# Altium schematic sheet board_pa94 (2).SchDoc
size 840 x 594 mm; SheetNumber: 1; SheetTotal: 1; Scale: 1:1
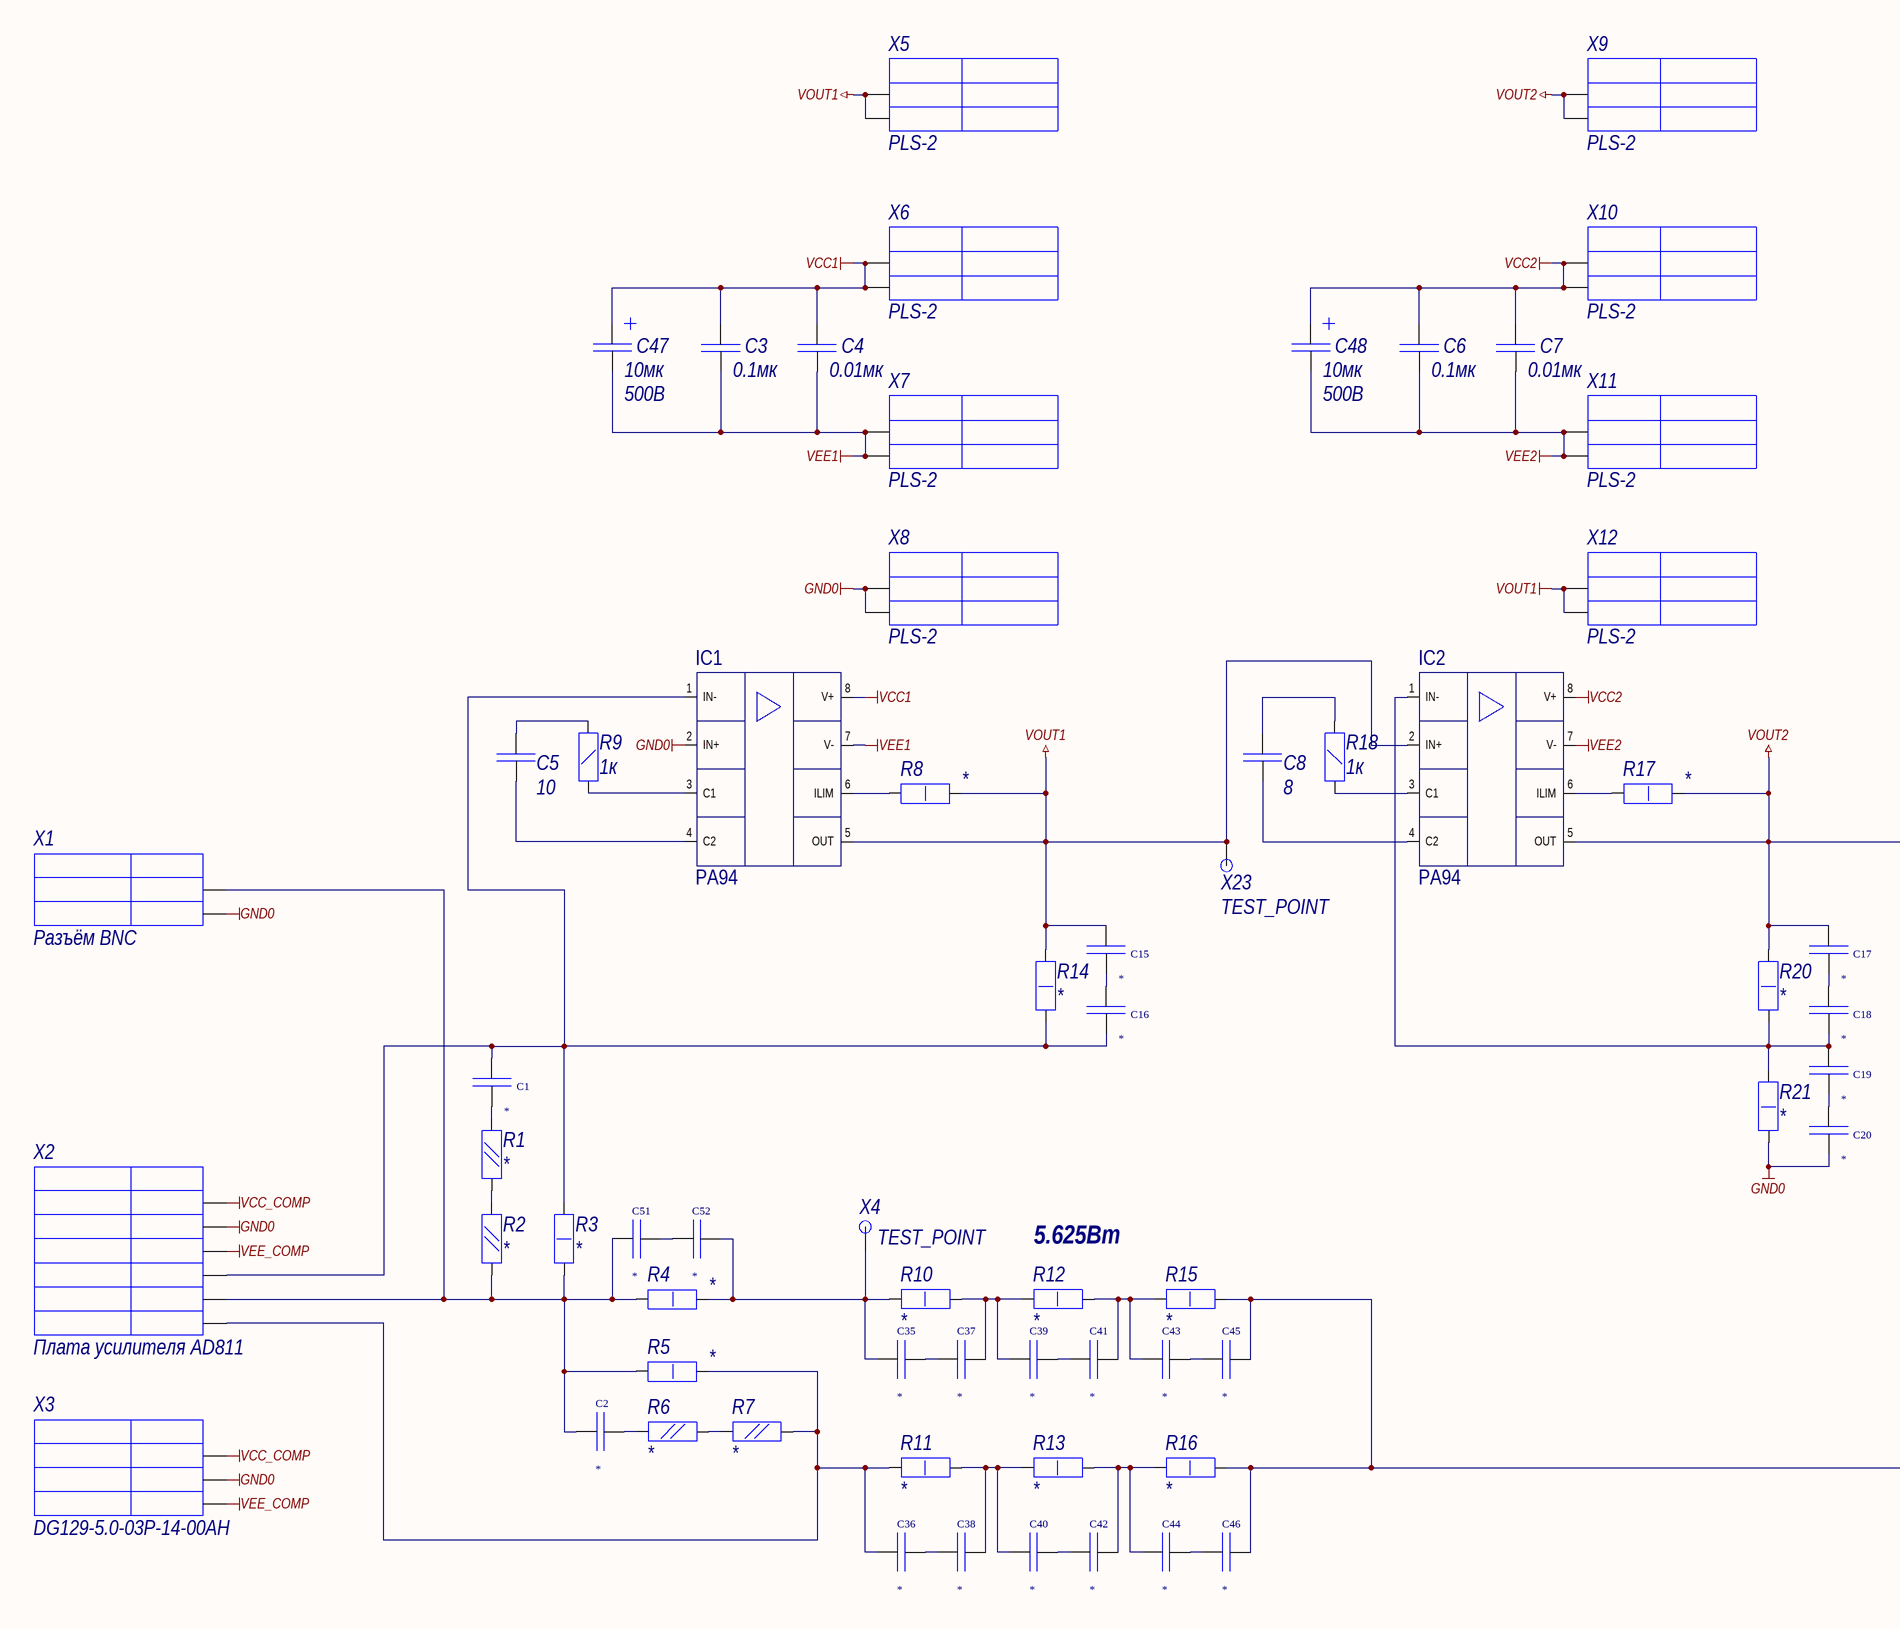
[diagram p0: board_pa94 (2).SchDoc, left]
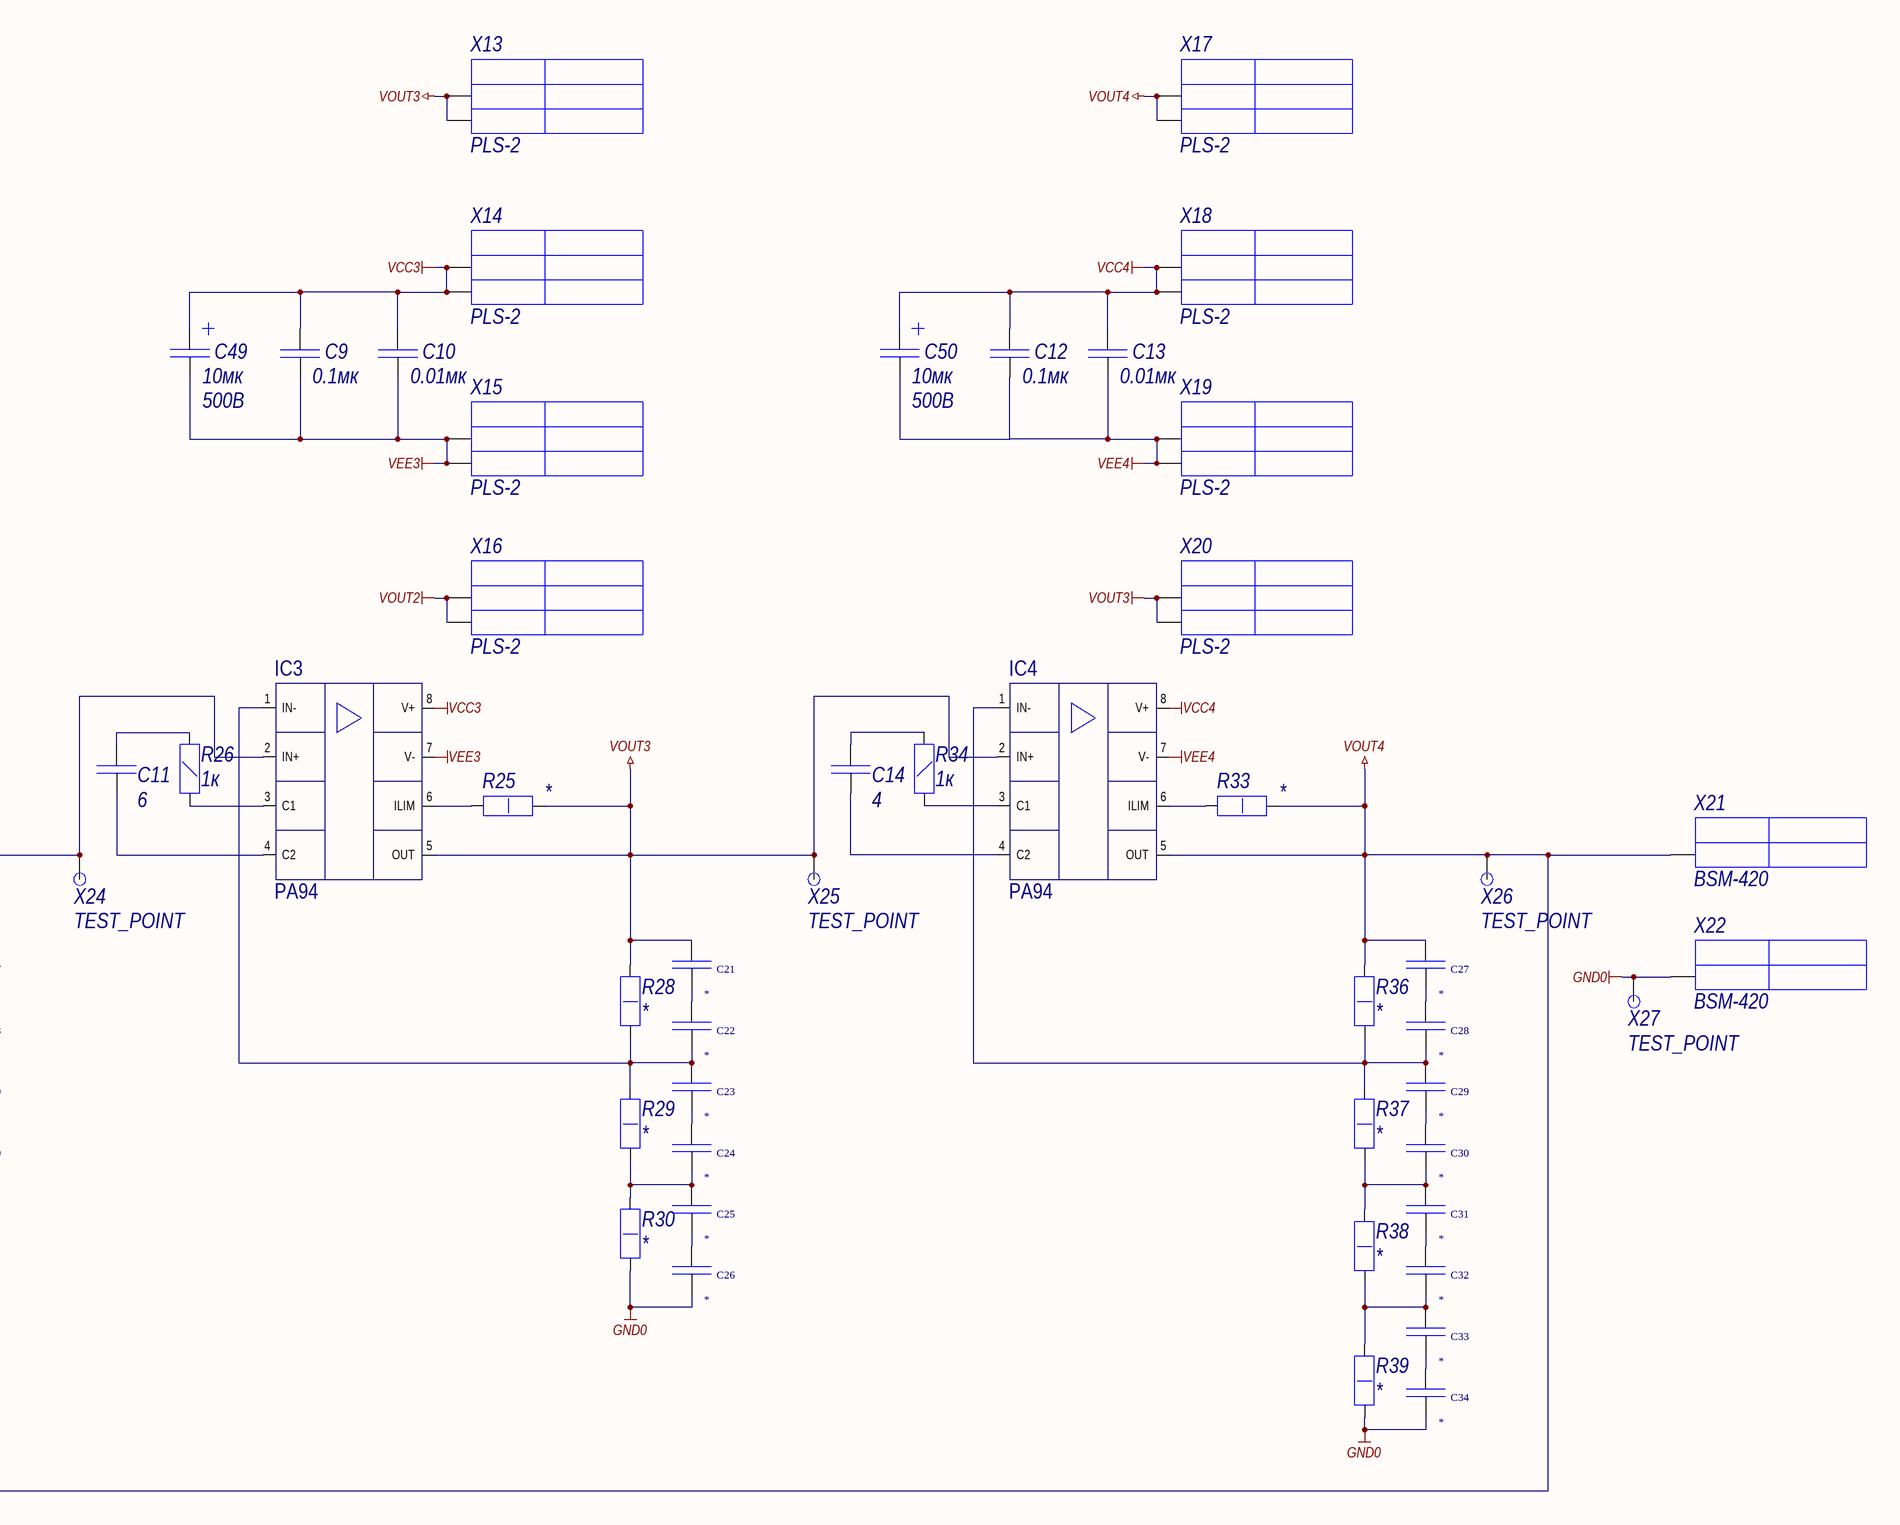
[diagram p1: board_pa94 (2).SchDoc, right]

## Parts
C1  *  [C-0805]
C2  *  [C-0805]
C3  0.1мк  [C-1812]
C4  0.01мк  [C-1206]
C5  10  [C-1206]
C6  0.1мк  [C-1812]
C7  0.01мк  [C-1206]
C8  8  [C-1206]
C9  0.1мк  [C-1812]
C10  0.01мк  [C-1206]
C11  6  [C-1206]
C12  0.1мк  [C-1812]
C13  0.01мк  [C-1206]
C14  4  [C-1206]
C15  *  [C-0805]
C16  *  [C-0805]
C17  *  [C-0805]
C18  *  [C-0805]
C19  *  [C-0805]
C20  *  [C-0805]
C21  *  [C-0805]
C22  *  [C-0805]
C23  *  [C-0805]
C24  *  [C-0805]
C25  *  [C-0805]
C26  *  [C-0805]
C27  *  [C-0805]
C28  *  [C-0805]
C29  *  [C-0805]
C30  *  [C-0805]
C31  *  [C-0805]
C32  *  [C-0805]
C33  *  [C-0805]
C34  *  [C-0805]
C35  *  [C-0805]
C36  *  [C-0805]
C37  *  [C-0805]
C38  *  [C-0805]
C39  *  [C-0805]
C40  *  [C-0805]
C41  *  [C-0805]
C42  *  [C-0805]
C43  *  [C-0805]
C44  *  [C-0805]
C45  *  [C-0805]
C46  *  [C-0805]
C47  10мк  Voltage: 500В  [CAP: D10C5H12.5]
C48  10мк  Voltage: 500В  [CAP: D10C5H12.5]
C49  10мк  Voltage: 500В  [CAP: D10C5H12.5]
C50  10мк  Voltage: 500В  [CAP: D10C5H12.5]
C51  *  [C-0805]
C52  *  [C-0805]
IC1  PA94  [PCBComponent_1]
IC2  PA94  [PCBComponent_1]
IC3  PA94  [PCBComponent_1]
IC4  PA94  [PCBComponent_1]
R1  *  [R-0805]
R2  *  [R-0805]
R3  *  [R-2512]
R4  *  [R-2512]
R5  *  [R-2512]
R6  *  [R-0805]
R7  *  [R-0805]
R8  *  [R-2512]
R9  1к  [R-1206]
R10  *  [R-2512]
R11  *  [R-2512]
R12  *  [R-2512]
R13  *  [R-2512]
R14  *  [R-2512]
R15  *  [R-2512]
R16  *  [R-2512]
R17  *  [R-2512]
R18  1к  [R-1206]
R20  *  [R-2512]
R21  *  [R-2512]
R25  *  [R-2512]
R26  1к  [R-1206]
R28  *  [R-2512]
R29  *  [R-2512]
R30  *  [R-2512]
R33  *  [R-2512]
R34  1к  [R-1206]
R36  *  [R-2512]
R37  *  [R-2512]
R38  *  [R-2512]
R39  *  [R-2512]
X1  Разъём BNC  [BNC]
X2  Плата усилителя AD811  [BOARD_AD811]
X3  DG129-5.0-03P-14-00AH  [DG129-5.0-03P-14-00AH]
X4  TEST_POINT  [TEST_POINT]  (net tie, no BOM)
X5  PLS-2  [PLS-2]
X6  PLS-2  [PLS-2]
X7  PLS-2  [PLS-2]
X8  PLS-2  [PLS-2]
X9  PLS-2  [PLS-2]
X10  PLS-2  [PLS-2]
X11  PLS-2  [PLS-2]
X12  PLS-2  [PLS-2]
X13  PLS-2  [PLS-2]
X14  PLS-2  [PLS-2]
X15  PLS-2  [PLS-2]
X16  PLS-2  [PLS-2]
X17  PLS-2  [PLS-2]
X18  PLS-2  [PLS-2]
X19  PLS-2  [PLS-2]
X20  PLS-2  [PLS-2]
X21  BSM-420  [BSM-420-R]
X22  BSM-420  [BSM-420-B]
X23  TEST_POINT  [TEST_POINT]  (net tie, no BOM)
X24  TEST_POINT  [TEST_POINT]  (net tie, no BOM)
X25  TEST_POINT  [TEST_POINT]  (net tie, no BOM)
X26  TEST_POINT  [TEST_POINT]  (net tie, no BOM)
X27  TEST_POINT  [TEST_POINT]  (net tie, no BOM)

## Nets
GND0: C20.2 C26.2 C34.2 IC1.2(IN+) R21.1 R30.1 R39.1 X1.2 X2.2 X3.2 X8.1 X8.2 X22.1 X27.1
VCC1: C3.2 C4.2 C47.1 IC1.8(V+) X6.1 X6.2
VCC2: C6.2 C7.2 C48.1 IC2.8(V+) X10.1 X10.2
VCC3: C9.2 C10.2 C49.1 IC3.8(V+) X14.1 X14.2
VCC4: C12.2 C13.2 C50.1 IC4.8(V+) X18.1 X18.2
VCC_COMP: X2.1 X3.1
VEE1: C3.1 C4.1 C47.2 IC1.7(V-) X7.1 X7.2
VEE2: C6.1 C7.1 C48.2 IC2.7(V-) X11.1 X11.2
VEE3: C9.1 C10.1 C49.2 IC3.7(V-) X15.1 X15.2
VEE4: C12.1 C13.1 C50.2 IC4.7(V-) X19.1 X19.2
VEE_COMP: X2.3 X3.3
VOUT1: C15.1 IC1.5(OUT) IC2.2(IN+) R8.2 R14.2 X5.1 X5.2 X12.1 X12.2 X23.1
VOUT2: C17.1 IC2.5(OUT) IC3.2(IN+) R17.2 R20.2 X9.1 X9.2 X16.1 X16.2 X24.1
VOUT3: C21.1 IC3.5(OUT) IC4.2(IN+) R25.2 R28.2 X13.1 X13.2 X20.1 X20.2 X25.1
VOUT4: C27.1 C45.1 C46.1 IC4.5(OUT) R15.1 R16.1 R33.2 R36.2 X17.1 X17.2 X21.1 X26.1
NetC1_1: C1.1 C16.2 IC1.1(IN-) R3.2 R14.1 X2.4
NetC1_2: C1.2 R1.2
NetC2_1: C2.1 C51.1 R2.1 R3.1 R4.1 R5.1 X1.1 X2.5
NetC2_2: C2.2 R6.2
NetC5_1: C5.1 R9.1
NetC5_2: C5.2 IC1.4(C2)
NetC8_1: C8.1 IC2.4(C2)
NetC8_2: C8.2 R18.2
NetC11_1: C11.1 IC3.4(C2)
NetC11_2: C11.2 R26.2
NetC14_1: C14.1 R34.1
NetC14_2: C14.2 IC4.4(C2)
NetC15_2: C15.2 C16.1
NetC17_2: C17.2 C18.1
NetC18_2: C18.2 C19.1 IC2.1(IN-) R20.1 R21.2
NetC19_2: C19.2 C20.1
NetC21_2: C21.2 C22.1
NetC22_2: C22.2 C23.1 IC3.1(IN-) R28.1 R29.2
NetC23_2: C23.2 C24.1
NetC24_2: C24.2 C25.1 R29.1 R30.2
NetC25_2: C25.2 C26.1
NetC27_2: C27.2 C28.1
NetC28_2: C28.2 C29.1 IC4.1(IN-) R36.1 R37.2
NetC29_2: C29.2 C30.1
NetC30_2: C30.2 C31.1 R37.1 R38.2
NetC31_2: C31.2 C32.1
NetC32_2: C32.2 C33.1 R38.1 R39.2
NetC33_2: C33.2 C34.1
NetC35_1: C35.1 C37.2
NetC35_2: C35.2 C52.2 R4.2 R10.2 X4.1
NetC36_1: C36.1 C38.2
NetC36_2: C36.2 R5.2 R7.1 R11.2 X2.6
NetC37_1: C37.1 C39.2 R10.1 R12.2
NetC38_1: C38.1 C40.2 R11.1 R13.2
NetC39_1: C39.1 C41.2
NetC40_1: C40.1 C42.2
NetC41_1: C41.1 C43.2 R12.1 R15.2
NetC42_1: C42.1 C44.2 R13.1 R16.2
NetC43_1: C43.1 C45.2
NetC44_1: C44.1 C46.2
NetC51_2: C51.2 C52.1
NetIC1_3: IC1.3(C1) R9.2
NetIC1_6: IC1.6(ILIM) R8.1
NetIC2_3: IC2.3(C1) R18.1
NetIC2_6: IC2.6(ILIM) R17.1
NetIC3_3: IC3.3(C1) R26.1
NetIC3_6: IC3.6(ILIM) R25.1
NetIC4_3: IC4.3(C1) R34.2
NetIC4_6: IC4.6(ILIM) R33.1
NetR1_1: R1.1 R2.2
NetR6_1: R6.1 R7.2

## Notes on the sheet
- 5.625Вт
- Перв. примен.
- Справ. №
- Подп. и дата
- Инв. № дубл.
- Взам. инв. №
- Разраб.
- Изм.
- Лист
- № докум.
- Подп.
- Дата
- Лит.
- Масса
- Масштаб
- Пров.
- Т.контр.
- Листов
- Инв. № подл.
- Утв.
- Н.контр.
- Копировал
- Формат А1

## Library data of the parts
C1 C2 C15-C46 C51 C52 = C0805: Voltage: *; ComponentDescription: =ComponentType+', '+Package+', '+Voltage+'В, '+Value+', '+Dielectric; ComponentType: Конденсатор керамический SMD; Dielectric: *; Package: C-0805; Value: *
C3 C6 C9 C12 = C1812: Voltage: 630; Dielectric: X7R; ComponentDescription: =ComponentType+', '+Package+', '+Voltage+'В, '+Value+', '+Dielectric; ComponentType: Конденсатор керамический SMD; Package: C-1812; Value: 0.1мк
C4 C7 C10 C13 = C1206: Voltage: 630; Dielectric: X7R; ComponentDescription: =ComponentType+', '+Package+', '+Voltage+'В, '+Value+', '+Dielectric; ComponentType: Конденсатор керамический SMD; Package: C-1206; Value: 0.01мк
C5 C8 C11 C14 = C1206: Voltage: 630В; Dielectric: NPO; ComponentDescription: =ComponentType+', '+Package+', '+Voltage+'В, '+Value+', '+Dielectric; ComponentType: Конденсатор керамический SMD; Package: C-1206
  C5: Value: 10
  C8: Value: 8
  C11: Value: 6
  C14: Value: 4
C47-C50 = Aluminum electrolytic capacitor: Конденсатор электролитический; Type: ESR; ComponentDescription: =ComponentType+', '+Value+', '+Voltage+', '+Type+', '+Package; ComponentType: Конденсатор электролитический; Package: CAP: D10C5H12.5; Value: 10мк
IC1-IC4 = PA94: Power Amplifier 1 Circuit 8-SIP; MF: Apex Microtechnology; SnapEDA_Link: https://www.snapeda.com/parts/PA94/Apex%20Microtechnology/view-part/585649/?ref=snap; Digi-Key_Part_Number: 598-1334-ND; Package: SIP-8 Apex Microtechnology; MP: PA94; Digi-Key_Purchase_URL: https://www.digikey.com.ua/product-detail/en/apex-microtechnology/PA94/598-1334-ND/1761958?utm_source=snapeda&utm_medium=aggregator&utm_campaign=symbol; Value: *
R1 R2 R6 R7 = R0805: Резистор SMD; Tolerance: 5%; ComponentDescription: =ComponentType+', '+ Package +', '+Value+'Ом, ' + Tolerance; ComponentType: Резистор SMD; Package: R-0805; Value: *
R3-R5 R8 R10-R17 R20 R21 R25 R28-R30 R33 R36-R39 = R2512: Резистор SMD; Tolerance: 5%; ComponentDescription: =ComponentType+', '+ Package +', '+Value+'Ом, ' + Tolerance; ComponentType: Резистор SMD; Package: R-2512; Value: *
R9 R18 R26 R34 = R1206: Резистор SMD; Tolerance: 5%; ComponentDescription: =ComponentType+', '+ Package +', '+Value+'Ом, ' + Tolerance; ComponentType: Резистор SMD; Package: R-1206; Value: 1к
X1 = BNC: Разъём; PartNumber: 32K249-400L5; Design Note: Footprint in library is a generic example - only application specific footprint delivers High Performance; ComponentDescription: Разъём антенный, Разъём BNC; ComponentTypе: Разъём антенный; DatasheetVersion: b00; PackageVersion: b00; PackageReference: 32K249-400L5; PackageDescription: SMA Right Angle Jack, 14.8 x 6.35 x 9.7 mm; Mounting Technology: Through Hole; ComponentLink1Description: Manufacturer URL; ComponentLink1URL: http://www.rosenberger.de; ComponentLink2Description: Datasheet; ComponentLink2URL: http://rosenberger.de/ok/images/documents/db/32K249-400L5.pdf; ComponentLink3Description: Package Specification; ComponentLink3URL: http://rosenberger.de/ok/images/documents/db/32K249-400L5.pdf; ComponentLink4Description: Series Overview / Design Note; ComponentLink4URL: http://rosenberger.de/ok/images/documents/spez/32.pdf; ComponentLink5Description: Webshop / RFQ; ComponentLink5URL: http://www.rosenberger.com/en/contact/sales/
X2 = BOARD_AD811: ComponentDescription: Плата усилителя AD811
X3 = DG129-5.0-03P-14-00AH: Разъем винтовой; ComponentDescription: Разъем винтовой, DG129-5.0-03P-14-00AH; ComponentTypе: Разъем винтовой
X4 X23-X27 = TEST_POINT: Тестовый контакт
X5-X20 = PLS-2: Разъём штыревой; ComponentDescription: Разъём штыревой, PLS-2; ComponentTypе: Разъём штыревой
X21 X22 = BSM-420: Разъём; PartNumber: 32K249-400L5; Design Note: Footprint in library is a generic example - only application specific footprint delivers High Performance; ComponentDescription: Разъём антенный, BSM-420; ComponentTypе: Разъём антенный; DatasheetVersion: b00; PackageVersion: b00; PackageReference: 32K249-400L5; PackageDescription: SMA Right Angle Jack, 14.8 x 6.35 x 9.7 mm; Mounting Technology: Through Hole; ComponentLink1Description: Manufacturer URL; ComponentLink1URL: http://www.rosenberger.de; ComponentLink2Description: Datasheet; ComponentLink2URL: http://rosenberger.de/ok/images/documents/db/32K249-400L5.pdf; ComponentLink3Description: Package Specification; ComponentLink3URL: http://rosenberger.de/ok/images/documents/db/32K249-400L5.pdf; ComponentLink4Description: Series Overview / Design Note; ComponentLink4URL: http://rosenberger.de/ok/images/documents/spez/32.pdf; ComponentLink5Description: Webshop / RFQ; ComponentLink5URL: http://www.rosenberger.com/en/contact/sales/